# EAGLE schematic scheme (EAGLE 9.4.2)
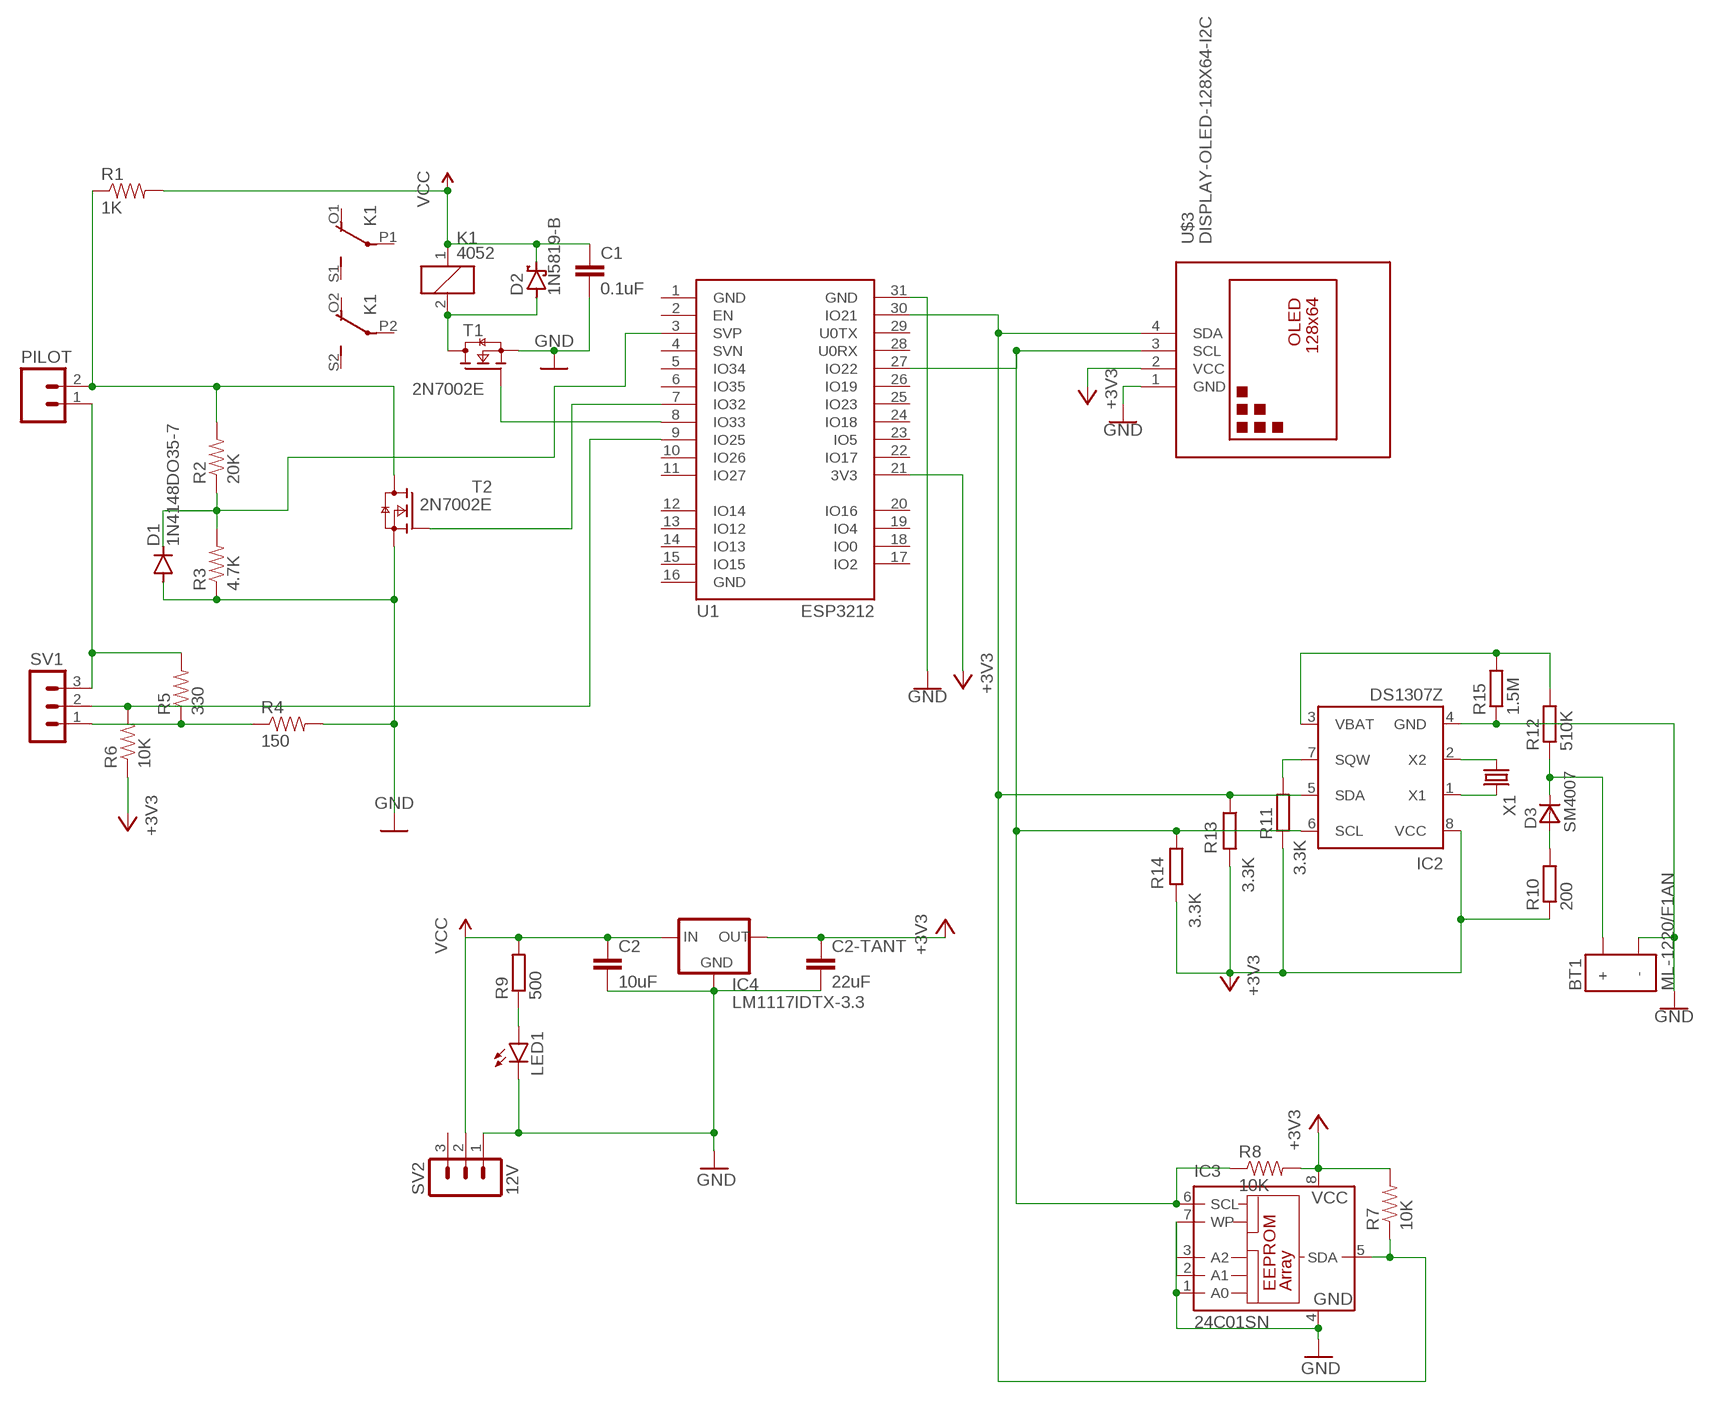
[diagram p0: schematic, sheet 1]

## Parts
BT1  ML-1220/F1AN  [ML-1220/F1BN]
C1  0.1uF  0.1UF-KIT-EZ-50V-20%  [CAP-PTH-SMALL-KIT]
C2  10uF  C-EUC0805  [C0805]
C2-TANT  22uF  C-EUC3216  [C3216]
D1  1N4148DO35-7  [DO35-7]
D2  1N5819-B  [DO41-7.6]
D3  SM4007  [MELF-MLL41]
IC2  DS1307Z  [SOIC8]
IC3  24C01SN  [SO-08]
IC4  LM1117IDTX-3.3  [TO252]
K1  4052  [F4052]
LED1  LEDCHIP-LED0805  [CHIP-LED0805]
PILOT  SPARKFUN_M02POLAR_LOCK  [SPARKFUN_MOLEX-1X2_LOCK]
R1  1K  SPARKFUN_RESISTORPTH-1/2W  [SPARKFUN_AXIAL-0.5]
R2  20K  SPARKFUN_RESISTORPTH-1/2W  [SPARKFUN_AXIAL-0.5]
R3  4.7K  SPARKFUN_RESISTORPTH-1/2W  [SPARKFUN_AXIAL-0.5]
R4  150  SPARKFUN_RESISTORPTH-1/2W  [SPARKFUN_AXIAL-0.5]
R5  330  SPARKFUN_RESISTORPTH-1/2W  [SPARKFUN_AXIAL-0.5]
R6  10K  SPARKFUN_RESISTORPTH-1/2W  [SPARKFUN_AXIAL-0.5]
R7  10K  SPARKFUN_RESISTORPTH-1/2W  [SPARKFUN_AXIAL-0.5]
R8  10K  SPARKFUN_RESISTORPTH-1/2W  [SPARKFUN_AXIAL-0.5]
R9  500  R-EU_R0805  [R0805]
R10  200  R-EU_R0805  [R0805]
R11  3.3K  R-EU_R0805  [R0805]
R12  510K  R-EU_R0805  [R0805]
R13  3.3K  R-EU_R0805  [R0805]
R14  3.3K  R-EU_R0805  [R0805]
R15  1.5M  R-EU_R0805  [R0805]
SV1  MA03-1  [MA03-1]
SV2  12V  MA03-1  [MA03-1]
T1  2N7002E  [SOT23]
T2  2N7002E  [SOT23]
U1  ESP3212  [ESP3212]
U$3  DISPLAY-OLED-128X64-I2C  [DISPLAY-OLED-128X64-I2C]
X1  CRYSTALS-NOGND-WATCH-3X8  [WATCH-3X8]

## Nets
+3V3: C2-TANT.1 IC2.8(VCC) IC3.8(VCC) IC4.TAB(OUT) R6.P$1 R7.P$2 R8.P$2 R10.1 R11.1 R13.2 R14.2 U1.21(3V3) U$3.2(VCC)
GND: BT1.NEG(-) C1.2 C2-TANT.2 C2.2 D1.A IC2.4(GND) IC3.1(A0) IC3.2(A1) IC3.3(A2) IC3.4(GND) IC3.7(WP) IC4.1(GND) LED1.C R3.P$1 R4.P$2 R15.1 SV2.1 T1.2(S) T2.2(S) U1.31(GND) U$3.1(GND)
N$1: LED1.A R9.1
N$2: IC2.1(X1) X1.2
N$6: T1.1(G) U1.8(IO33)
N$8: D2.A K1.2 T1.3(D)
N$9: T2.1(G) U1.7(IO32)
N$10: PILOT.2 R1.P$1 R2.P$2 T2.3(D)
N$11: D1.C R2.P$1 R3.P$2 U1.3(SVP)
N$12: R4.P$1 R5.P$1 SV1.1
N$13: PILOT.1 R5.P$2 SV1.3
N$14: R6.P$2 SV1.2 U1.9(IO25)
N$15: IC2.7(SQW) R11.2
N$16: IC2.2(X2) X1.1
N$17: IC2.6(SCL) IC3.6(SCL) R8.P$1 R14.1 U1.27(IO22) U$3.3(SCL)
N$18: IC2.5(SDA) IC3.5(SDA) R7.P$1 R13.1 U1.30(IO21) U$3.4(SDA)
N$19: IC2.3(VBAT) R12.2 R15.2
N$20: BT1.POS(+) D3.C R12.1
N$22: D3.A R10.2
VCC: C1.1 C2.1 D2.C IC4.2(IN) K1.1 R1.P$2 R9.2 SV2.2
Unconnected: K1.O1(2:O) K1.O2(3:O) K1.P1(2:P) K1.P2(3:P) K1.S1(2:S) K1.S2(3:S) SV2.3 U1.2(EN) U1.4(SVN) U1.5(IO34) U1.6(IO35) U1.10(IO26) U1.11(IO27) U1.12(IO14) U1.13(IO12) U1.14(IO13) U1.15(IO15) U1.17(IO2) U1.18(IO0) U1.19(IO4) U1.20(IO16) U1.22(IO17) U1.23(IO5) U1.24(IO18) U1.25(IO23) U1.26(IO19) U1.28(U0RX) U1.29(U0TX)

## Power pins joined to a net without a drawn wire
GND: U1.1(GND) U1.16(GND)

## Library data of the parts
BT1 = batteries:ML-1220/F1AN: BATTERY LITH 3V RECHARGE PC PINS; DIGIKEY: P663-nd; MOUSER: 658-ML-1220/F1BN
C1 = SparkFun-Capacitors:0.1UF: 0.1µF ceramic capacitors A capacitor is a passive two-terminal electrical component used to store electrical energy temporarily in an electric field.; PROD_ID: CAP-08370
C2 C2-TANT = rcl:C-EU: CAPACITOR, European symbol; SPICEPREFIX: C
D1 = diode:1N4148: DIODE high speed (Philips)
D2 = diode:1N581*: 1.0A SCHOTTKY BARRIER RECTIFIER Source: http://www.diodes.com/datasheets/ds23001.pdf
D3 = _mod_diode:SM400*: SM4001 .. SM4007 General Purpose Rectifier, 1 A SMD-Version of 1N4001 .. 1N4007 Case: MELF-MLL41 = DO 213 AB Author: Dipl.-Ing. FH Rainer Bayer HHN Hochschule Heilbronn, rainer.bayer@hs-heilbronn.de Ingenieurbüro ing-rb, mail@ing-rb.de
IC2 = ds1307_pcf8583:DS1307: I2C-Bus CLOCK/CALENDAR
IC3 = microchip:24C*: Serial EEPROM 1 K/2 K/4 K; MPN: CAT24C01WI-GT3; OC_FARNELL: 1718117; OC_NEWARK: 06R0487
IC4 = lm1117:LM1117IDTX-*
K1 = relay:4052: RELAY 2 x switch, Finder; OC_FARNELL: unknown; OC_NEWARK: unknown
LED1 = led:LED: LED OSRAM: - CHIPLED LG R971, LG N971, LY N971, LG Q971, LY Q971, LO R971, LY R971 LH N974, LH R974 LS Q976, LO Q976, LY Q976 LO Q996 - Hyper CHIPLED LW Q18S LB Q993, LB Q99A, LB R99A - SideLED LS A670, LO A670, LY A670, LG A670, LP A670 LB A673, LV A673, LT A673, LW A673 LH A674 LY A675 LS A676, LA A676, LO A676, LY A676, LW A676 LS A679, LY A679, LG A679 - Hyper Micro SIDELED® LS Y876, LA Y876, LO Y876, LY Y876 LT Y87S - SmartLED LW L88C, LW L88S LB L89C, LB L89S, LG L890 LS L89K, LO L89K, LY L89K LS L896, LA L896, LO L896, LY L896 - TOPLED LS T670, LO T670, LY T670, LG T670, LP T670 LSG T670, LSP T670, LSY T670, LOP T670, LYG T670 LG T671, LOG T671, LSG T671 LB T673, LV T673, LT T673, LW T673 LH T674 LS T676, LA T676, LO T676, LY T676, LB T676, LH T676, LSB T676, LW T676 LB T67C, LV T67C, LT T67C, LS T67K, LO T67K, LY T67K, LW E67C LS E67B, LA E67B, LO E67B, LY E67B, LB E67C, LV E67C, LT E67C LW T67C LS T679, LY T679, LG T679 LS T770, LO T770, LY T770, LG T770, LP T770 LB T773, LV T773, LT T773, LW T773 LH T774 LS E675, LA E675, LY E675, LS T675 LS T776, LA T776, LO T776, LY T776, LB T776 LHGB T686 LT T68C, LB T68C - Hyper Mini TOPLED® LB M676 - Mini TOPLED Santana® LG M470 LS M47K, LO M47K, LY M47K Source: http://www.osram.convergy.de LUXEON: - LUMILED® LXK2-PW12-R00, LXK2-PW12-S00, LXK2-PW14-U00, LXK2-PW14-V00 LXK2-PM12-R00, LXK2-PM12-S00, LXK2-PM14-U00 LXK2-PE12-Q00, LXK2-PE12-R00, LXK2-PE12-S00, LXK2-PE14-T00, LXK2-PE14-U00 LXK2-PB12-K00, LXK2-PB12-L00, LXK2-PB12-M00, LXK2-PB14-N00, LXK2-PB14-P00, LXK2-PB14-Q00 LXK2-PR12-L00, LXK2-PR12-M00, LXK2-PR14-Q00, LXK2-PR14-R00 LXK2-PD12-Q00, LXK2-PD12-R00, LXK2-PD12-S00 LXK2-PH12-R00, LXK2-PH12-S00 LXK2-PL12-P00, LXK2-PL12-Q00, LXK2-PL12-R00 Source: www.luxeon.com KINGBRIGHT: KA-3528ASYC Source: www.kingbright.com
PILOT = antduino:SPARKFUN_M02: Header 2 Standard 2-pin 0.1" header. Use with straight break away headers (SKU : PRT-00116), right angle break away headers (PRT-00553), swiss pins (PRT-00743), machine pins (PRT-00117), and female headers (PRT-00115). Molex polarized connector foot print use with SKU : PRT-08233 with associated crimp pins and housings.
R1-R8 = antduino:SPARKFUN_RESISTOR: Resistor Basic schematic elements and footprints for 0603, 1206, and PTH resistors.
R9-R15 = rcl:R-EU_: RESISTOR, European symbol; SPICEPREFIX: R
SV1 SV2 = con-lstb:MA03-1: PIN HEADER; OC_FARNELL: unknown; OC_NEWARK: unknown
T1 T2 = nxp_60:2N7002: N-channel TrenchMOS FET N-channel enhancement mode Field-Effect Transistor (FET) in a plastic package using TrenchMOS technology. AAL Eindhoven MK
U1 = esp32:ESP3212: Ai-Thinker ESP3212 (Obsolete)
U$3 = diy-modules:DISPLAY-OLED-128X64-I2C: 128x64 Dot Matrix OLED Module based on SSD1306 chip Variant with I2C interface More details available here: http://www.instructables.com/id/Monochrome-096-i2c-OLED-display-with-arduino-SSD13/ SSD1306 datasheet: https://cdn-shop.adafruit.com/datasheets/SSD1306.pdf Click here to find device on ebay.com <http://www.ebay.com/sch/oled+display+128x64+iic> Note: There are two variants: I2C and SPI. Search for the proper version.
X1 = IQD-Frequency-Products:CRYSTALS-NOGND: CRYSTALS CAN NOT GROUNDED